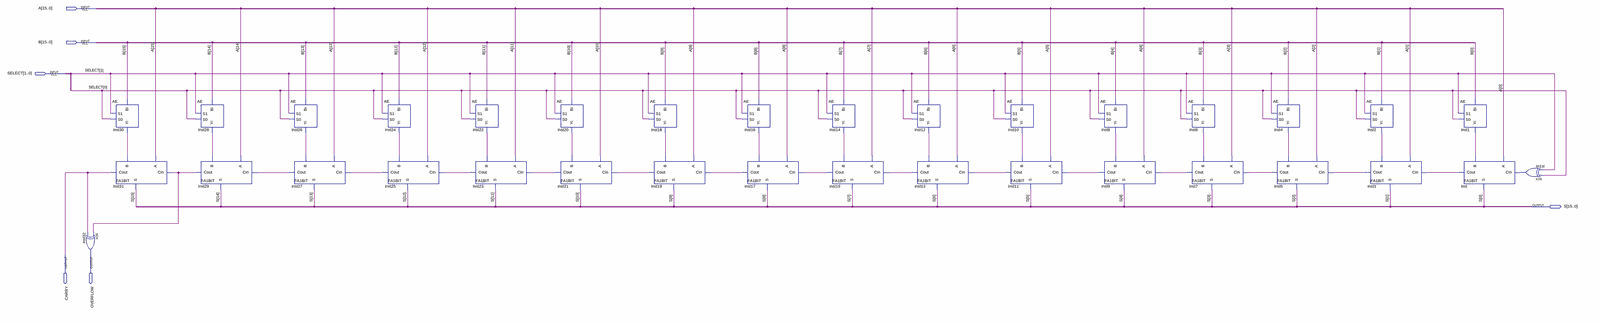
[diagram p0: schematic sheet, whole]
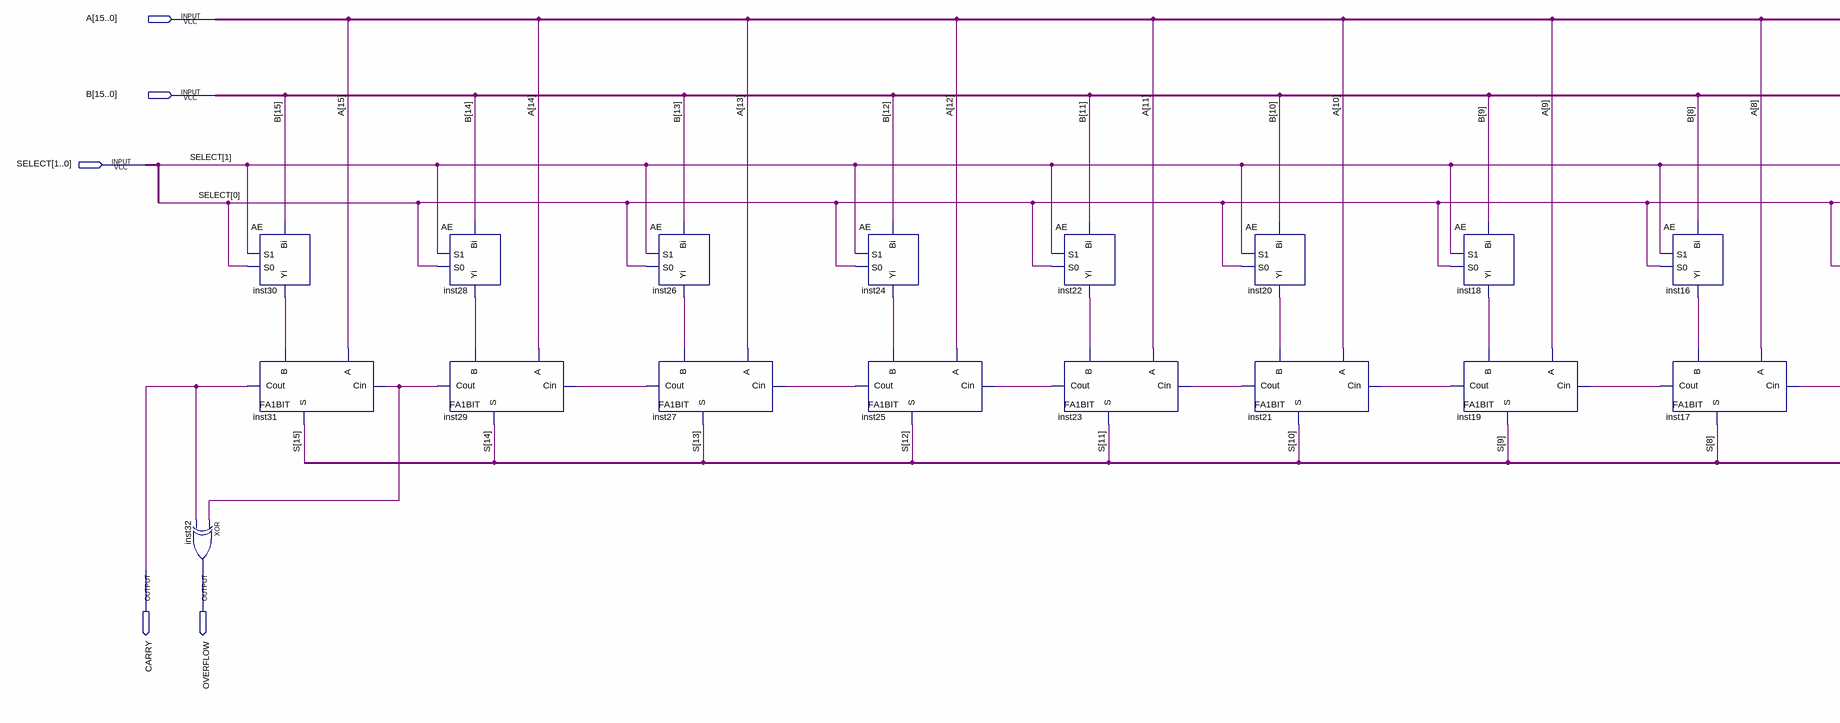
[diagram p1: schematic sheet, left part]
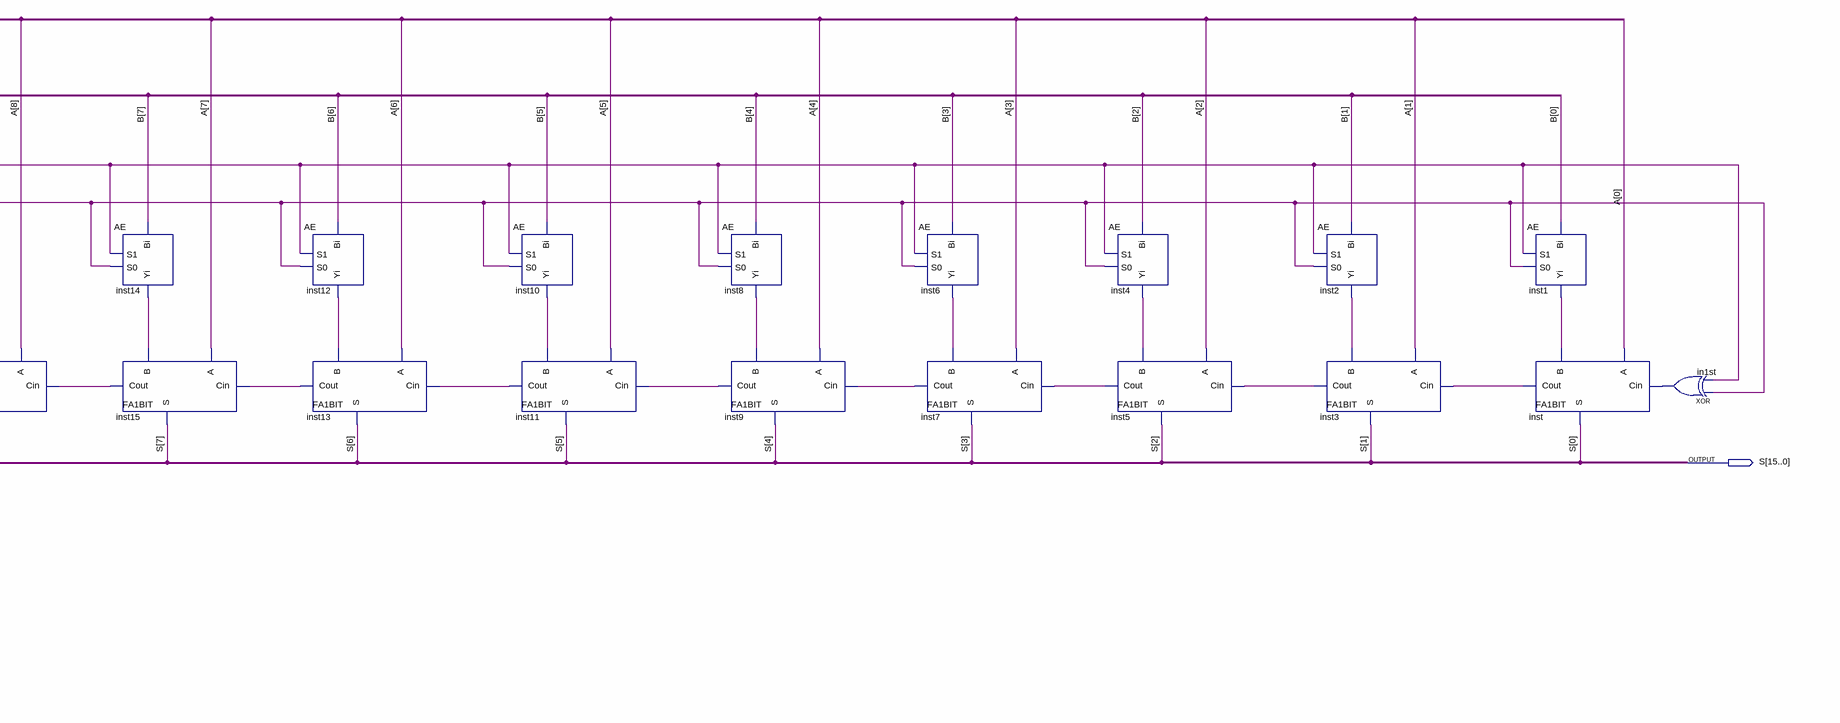
[diagram p2: schematic sheet, right part]
// Quartus schematic AU.bdf as structural Verilog: 34 symbols, 6 pins
module AU (
  input  [15:0] A,
  input  [15:0] B,
  input  [1:0] SELECT,
  output [15:0] S,
  output CARRY,
  output OVERFLOW
);

  wire in1st_out, inst1_yi, inst2_yi, inst3_cout, inst4_yi, inst5_cout, inst6_yi, inst7_cout, inst8_yi,
       inst9_cout, inst10_yi, inst11_cout, inst12_yi, inst13_cout, inst14_yi, inst15_cout, inst16_yi,
       inst17_cout, inst18_yi, inst19_cout, inst20_yi, inst21_cout, inst22_yi, inst23_cout, inst24_yi,
       inst25_cout, inst26_yi, inst27_cout, inst28_yi, inst29_cout, inst30_yi, inst_cout;

  xor inst32 (OVERFLOW, inst29_cout, CARRY);
  AE inst30 (.Bi(B[15]), .S1(SELECT[1]), .S0(SELECT[0]), .Yi(inst30_yi));
  FA1BIT inst31 (.Cin(inst29_cout), .A(A[15]), .B(inst30_yi), .Cout(CARRY), .S(S[15]));
  AE inst28 (.Bi(B[14]), .S1(SELECT[1]), .S0(SELECT[0]), .Yi(inst28_yi));
  FA1BIT inst29 (.Cin(inst27_cout), .A(A[14]), .B(inst28_yi), .Cout(inst29_cout), .S(S[14]));
  AE inst26 (.Bi(B[13]), .S1(SELECT[1]), .S0(SELECT[0]), .Yi(inst26_yi));
  FA1BIT inst27 (.Cin(inst25_cout), .A(A[13]), .B(inst26_yi), .Cout(inst27_cout), .S(S[13]));
  AE inst24 (.Bi(B[12]), .S1(SELECT[1]), .S0(SELECT[0]), .Yi(inst24_yi));
  FA1BIT inst25 (.Cin(inst23_cout), .A(A[12]), .B(inst24_yi), .Cout(inst25_cout), .S(S[12]));
  AE inst22 (.Bi(B[11]), .S1(SELECT[1]), .S0(SELECT[0]), .Yi(inst22_yi));
  FA1BIT inst23 (.Cin(inst21_cout), .A(A[11]), .B(inst22_yi), .Cout(inst23_cout), .S(S[11]));
  AE inst20 (.Bi(B[10]), .S1(SELECT[1]), .S0(SELECT[0]), .Yi(inst20_yi));
  FA1BIT inst21 (.Cin(inst19_cout), .A(A[10]), .B(inst20_yi), .Cout(inst21_cout), .S(S[10]));
  AE inst18 (.Bi(B[9]), .S1(SELECT[1]), .S0(SELECT[0]), .Yi(inst18_yi));
  FA1BIT inst19 (.Cin(inst17_cout), .A(A[9]), .B(inst18_yi), .Cout(inst19_cout), .S(S[9]));
  AE inst16 (.Bi(B[8]), .S1(SELECT[1]), .S0(SELECT[0]), .Yi(inst16_yi));
  FA1BIT inst17 (.Cin(inst15_cout), .A(A[8]), .B(inst16_yi), .Cout(inst17_cout), .S(S[8]));
  AE inst14 (.Bi(B[7]), .S1(SELECT[1]), .S0(SELECT[0]), .Yi(inst14_yi));
  FA1BIT inst15 (.Cin(inst13_cout), .A(A[7]), .B(inst14_yi), .Cout(inst15_cout), .S(S[7]));
  AE inst12 (.Bi(B[6]), .S1(SELECT[1]), .S0(SELECT[0]), .Yi(inst12_yi));
  FA1BIT inst13 (.Cin(inst11_cout), .A(A[6]), .B(inst12_yi), .Cout(inst13_cout), .S(S[6]));
  AE inst10 (.Bi(B[5]), .S1(SELECT[1]), .S0(SELECT[0]), .Yi(inst10_yi));
  FA1BIT inst11 (.Cin(inst9_cout), .A(A[5]), .B(inst10_yi), .Cout(inst11_cout), .S(S[5]));
  AE inst8 (.Bi(B[4]), .S1(SELECT[1]), .S0(SELECT[0]), .Yi(inst8_yi));
  FA1BIT inst9 (.Cin(inst7_cout), .A(A[4]), .B(inst8_yi), .Cout(inst9_cout), .S(S[4]));
  AE inst6 (.Bi(B[3]), .S1(SELECT[1]), .S0(SELECT[0]), .Yi(inst6_yi));
  FA1BIT inst7 (.Cin(inst5_cout), .A(A[3]), .B(inst6_yi), .Cout(inst7_cout), .S(S[3]));
  AE inst4 (.Bi(B[2]), .S1(SELECT[1]), .S0(SELECT[0]), .Yi(inst4_yi));
  FA1BIT inst5 (.Cin(inst3_cout), .A(A[2]), .B(inst4_yi), .Cout(inst5_cout), .S(S[2]));
  AE inst2 (.Bi(B[1]), .S1(SELECT[1]), .S0(SELECT[0]), .Yi(inst2_yi));
  FA1BIT inst3 (.Cin(inst_cout), .A(A[1]), .B(inst2_yi), .Cout(inst3_cout), .S(S[1]));
  AE inst1 (.Bi(B[0]), .S1(SELECT[1]), .S0(SELECT[0]), .Yi(inst1_yi));
  FA1BIT inst (.Cin(in1st_out), .A(A[0]), .B(inst1_yi), .Cout(inst_cout), .S(S[0]));
  xor in1st (in1st_out, SELECT[0], SELECT[1]);
endmodule
